# Altium project MosaicT_RCB.PrjPcb
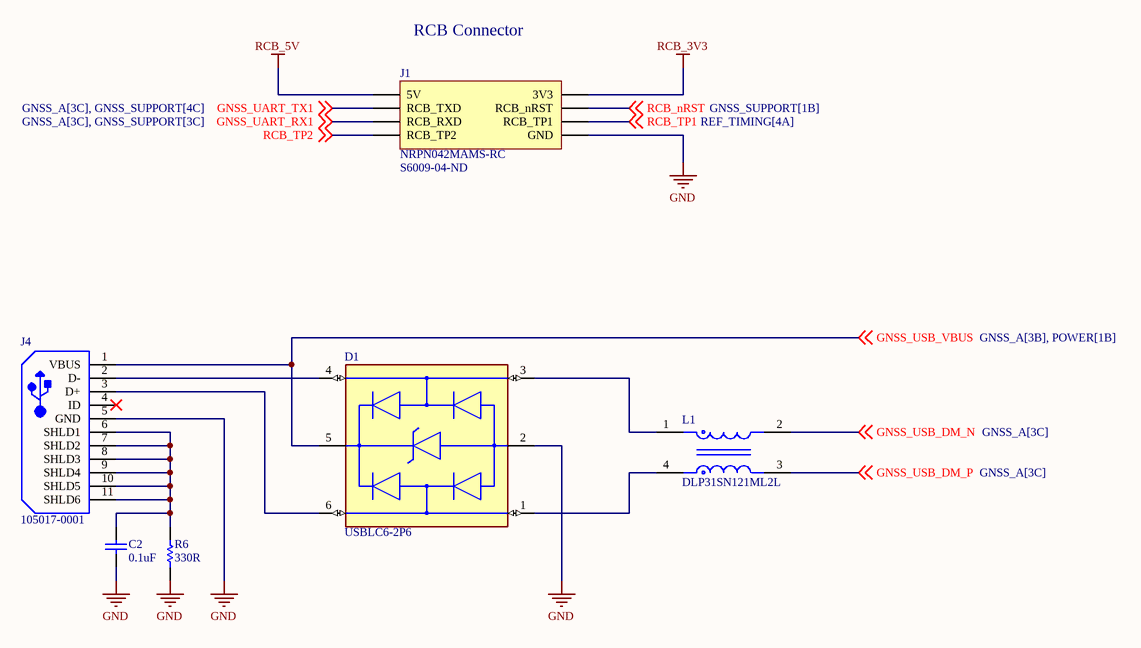
[diagram p0: CONNECTORS.SchDoc]
6 sheets, 78 parts. Net scope: global (net labels, ports and power ports of the same name join across sheets).
Board file: MOSAIC_RCB.PcbDoc
Sheets:
  CONNECTORS.SchDoc
  GNSS_A.SchDoc
  GNSS_B.SchDoc
  GNSS_SUPPORT.SchDoc
  REF_TIMING.SchDoc
  POWER.SchDoc

## Sheet CONNECTORS.SchDoc
size A4; SheetNumber: 2; SheetTotal: 7

### Parts
C2  0.1uF  [CAPC1005X56X25LL10T15]
D1  USBLC6-2P6  [FP-SOT-666-MFG]
J1  NRPN042MAMS-RC  Supplier Part Number 1: S6009-04-ND  [NRPN042MAMS-RC]
J4  105017-0001  [USB-MICRO-B_V]
L1  DLP31SN121ML2L  [FP-DLP31SN-MFG]
R6  330R  [RESC1005X40X25ML05T05]

### Nets
GND: C2.1 D1.2(GND) J1.8(GND) J4.5(GND) R6.1
RCB_3V3: J1.2(3V3)
RCB_5V: J1.1(5V)
GNSS_UART_RX1: J1.5(RCB_RXD) ; off-sheet GNSS_UART_RX1
GNSS_UART_TX1: J1.3(RCB_TXD) ; off-sheet GNSS_UART_TX1
GNSS_USB_DM_N: L1.2 ; off-sheet GNSS_USB_DM_N
GNSS_USB_DM_P: L1.3 ; off-sheet GNSS_USB_DM_P
GNSS_USB_VBUS: D1.5(VBUS) J4.1(VBUS) ; off-sheet GNSS_USB_VBUS
RCB_nRST: J1.4(RCB_nRST) ; off-sheet RCB_nRST
RCB_TP1: J1.6(RCB_TP1) ; off-sheet RCB_TP1
RCB_TP2: J1.7(RCB_TP2) ; off-sheet RCB_TP2
NetC2_2: C2.2 J4.6(SHLD1) J4.7(SHLD2) J4.8(SHLD3) J4.9(SHLD4) J4.10(SHLD5) J4.11(SHLD6) R6.2
NetD1_1: D1.1(I/O1) L1.4
NetD1_3: D1.3(I/O2) L1.1
NetD1_4: D1.4(I/O2) J4.2(D-)
NetD1_6: D1.6(I/O1) J4.3(D+)

Not connected (* = marked no-connect by the designer): J4 4(ID)*

### Notes on the sheet
- RCB Connector

### Library data of the parts
C2 = CMP-2008-02743-1: Manufacturer: AVX Interconnect / Elco; Part Number: 04026D104KAT2A
D1 = CMP-12225-000058-1: TVS DIODE 5.25V 17V SOT666; Min Breakdown Voltage: 6V; Power Line Protection: Yes; Element Configuration: Dual; Test Current: 1mA; Working Voltage: 5V; Number of Channels: 2; Max Reverse Leakage Current: 150nA; Direction: Unidirectional; Peak Pulse Current: 5A; Number of Elements: 1; Capacitance: 3.5pF; Max Breakdown Voltage: 6V; Height: 0.6mm; Depth: 1.3mm; Contact Plating: Tin; Reverse Breakdown Voltage: 6V; REACH SVHC: No SVHC; Operating Supply Voltage: 5V; Width: 1.3mm; Max Operating Temperature: 125°C; Reverse Standoff Voltage: 5V; ESD Protection: Yes; Package Quantity: 1; Termination: SMD/SMT; Length: 1.7mm; Leakage Current: 150nA; Number of Bidirectional Channels: 2; Case/Package: SOT-666; Min Operating Temperature: -40°C; Number of Pins: 6; Clamping Voltage: 17V; Breakdown Voltage: 6V; Lead Free: Lead Free; Radiation Hardening: No; Packaging: Tape and Reel; Mount: Surface Mount; Polarity: Unidirectional
J1 = NRPN042MAMS-RC: Dual Row 8 Position 2 mm Pitch Surface Mount Header; Manufacturer: Sullins; Number of Positions: 8; Connector Type: Male Pin; Pitch: 0.079inch; Supplier 1: Digi-Key; Manufacturer Part Number: NRPN042MAMS-RC; RoHS: Yes; Category: Connectors; Stock 1: 10801; Pricing 1: 1=0.76000, 76=0.60237, 152=0.57618, 456=0.47143, 988=0.41904, 4940=0.37830 (USD); Mount: Surface Mount; Color: Black; Contact Plating: Gold; Contact Material: Brass; Housing Material: Nylon; Package Quantity: 1000; Number of Rows: 2; Packaging: Bulk; Termination: Solder; Contact Type: Male Pin; Length: 8mm; Width: 4mm; Height: 1.5mm; Row Spacing: 0.079inch; Contact Mating Length: 0.141inch; Lead Free: Lead Free; RoHS Compliant: Yes; ComponentLink1URL: https://datasheet.ciiva.com/711/nrpnxx2mamx-rc-10495-d-711179.pdf?src-supplier=Digi-Key; ComponentLink1Description: https://datasheet.ciiva.com/711/nrpnxx2mamx-rc-10495-d-711179.pdf?src-supplier=Digi-Key
J4 = CMP-2000-05827-1: Micro-USB B Receptacle, Right Angle, Bottom Mount, Surface Mount, with Solder Tabs, -30 to 85 degC, 5-Pin USB, RoHS, Tape and Reel; Manufacturer: Molex; Featured Product: Micro-USBConnectorsUSBConnectors; Other Names: WM1399DKR; Package Version: Rev. F, 12/2012; Number of Contacts: 5; Connector Type: USB-microB; Catalog Drawings: 1050170001; 3D Model: 105017-0001.stp; Mating Products: WM17145-ND-CABLEMICROUSBBTOSTDA1.0MWM17147-ND-CABLEMICROUSBBTOSTDA2.0MWM17146-ND-CABLEMICROUSBBTOSTDA1.5M; PCN Assembly/Origin: ResinSupplier21/Oct/2015; Voltage - Max: 30V; Online Catalog: Molex-MicroUSB; Manufacturer URL: http://www.molex.com/; Package Description: 5-Leads USB, Micro B, Body 7.5 x 5 mm, Pitch 0.65 mm; Datasheet URL: http://www.molex.com/elqNow/elqRedir.htm?ref=http://www.molex.com/webdocs/datasheets/pdf/en-us/1050170001_IO_CONNECTORS.pdf; Ingress Protection: -; Datasheet Version: 03/2016; Mounting Type: BoardCutout,SurfaceMount,RightAngle; Circuits: 5; Standard Package: 1; Package Reference: MICRO-B; Package URL: http://www.molex.com/pdm_docs/sd/1050170001_sd.pdf; Category: Connectors,Interconnects; Series: -; RoHS Information: 1050170001CertofCompliance; Features: Shielded,SolderRetention; Family: USB,DVI,HDMIConnectors; Specifications: -; Gender: Receptacle; Packaging: Digi-Reel®; Mounting Technology: SurfaceMount
L1 = CMP-06045-000038-1: CMC 100MA 2LN 120 OHM SMD; Number of Lines: 2; Impedance: 120R; Shielding: Unshielded; Voltage Rating: 16V; Tolerance: 20%; DC Resistance (DCR): 2R; Test Frequency: 100MHz; Packaging: Tape and Reel; Depth: 1.75mm; Max Operating Temperature: 85°C; Current: 100mA; DC Current: 100mA; Case Code (Metric): 3216; Radiation Hardening: No; Military Standard: Not; Min Operating Temperature: -40°C; Package Quantity: 1; Length: 3.2mm; Current Rating: 100mA; Max DC Current: 100mA; Height: 1.15mm; Lead Free: Lead Free; Termination: SMD/SMT; Case Code (Imperial): 1206; Case/Package: 1206; Width: 0.063inch; Mount: Surface Mount
R6 = CMP-2002-01143-1: Manufacturer: Panasonic; Part Number: ERJ2RKF3300X

## Sheet GNSS_A.SchDoc
size A4; SheetNumber: 3; SheetTotal: 7
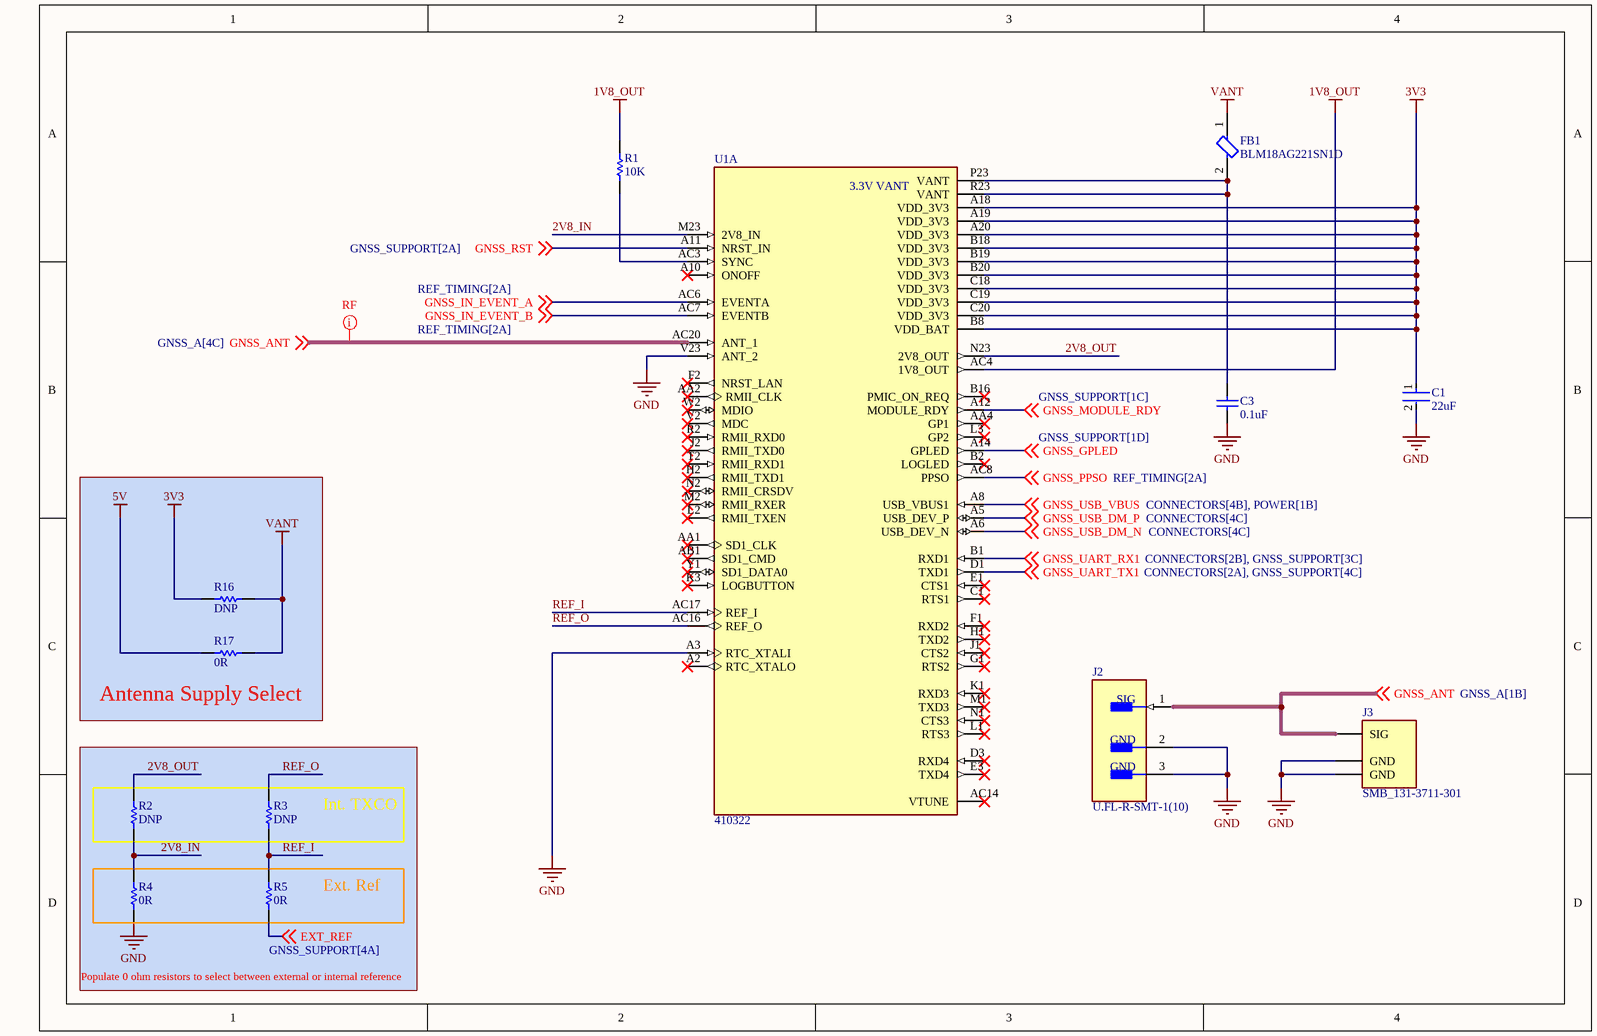
[diagram p1: GNSS_A.SchDoc]

### Parts
C1  22uF  [FP-CL10-IPC_B]
C3  0.1uF  [CAPC1005X56X25LL10T15]
FB1  BLM18AG221SN1D  [FP-BLM18-0_15-t0_8-IPC_A]
J2  U.FL-R-SMT-1(10)  [FP-U_FL-R-SMT-1_10-MFG]
J3  SMB_131-3711-301  [SMB_131-3711-301]
R1  10K  [RESC1005X40X25LL05T10]
R2  DNP  [RESC1005X40X25NL05T10]
R3  DNP  [RESC1005X40X25NL05T10]
R4  0R  [RESC1005X40X25NL05T10]
R5  0R  [RESC1005X40X25NL05T10]
R16  DNP  [RESC1005X40X25NL05T10]
R17  0R  [RESC1005X40X25NL05T10]
U1  410322  [LGA239C127P23X23_3100X3100X417N]  (part A of 3)

### Blocks framed on the sheet
Antenna Supply Select: R16 R17
Int. TXCO: R2 R3
Ext. Ref: R4 R5

### Nets
1V8_OUT: R1.2 U1.AC4(1V8_OUT)
3V3: C1.1 R16.1 U1.A18(VDD_3V3) U1.A19(VDD_3V3) U1.A20(VDD_3V3) U1.B8(VDD_BAT) U1.B18(VDD_3V3) U1.B19(VDD_3V3) U1.B20(VDD_3V3) U1.C18(VDD_3V3) U1.C19(VDD_3V3) U1.C20(VDD_3V3)
5V: R17.1
GND: C1.2 C3.1 J2.2(GND) J2.3(GND) J3.2(GND) J3.3(GND) R4.2 U1.A3(RTC_XTALI) U1.V23(ANT_2)
VANT: FB1.1 R16.2 R17.2
2V8_IN: R2.2 R4.1 U1.M23(2V8_IN)
2V8_OUT: R2.1 U1.N23(2V8_OUT)
EXT_REF: R5.2 ; off-sheet EXT_REF
GNSS_ANT: J2.1(SIG) J3.1(SIG) U1.AC20(ANT_1) ; off-sheet GNSS_ANT
GNSS_GPLED: U1.A14(GPLED) ; off-sheet GNSS_GPLED
GNSS_IN_EVENT_A: U1.AC6(EVENTA) ; off-sheet GNSS_IN_EVENT_A
GNSS_IN_EVENT_B: U1.AC7(EVENTB) ; off-sheet GNSS_IN_EVENT_B
GNSS_MODULE_RDY: U1.A12(MODULE_RDY) ; off-sheet GNSS_MODULE_RDY
GNSS_PPSO: U1.AC8(PPSO) ; off-sheet GNSS_PPSO
GNSS_RST: U1.A11(NRST_IN) ; off-sheet GNSS_RST
GNSS_UART_RX1: U1.B1(RXD1) ; off-sheet GNSS_UART_RX1
GNSS_UART_TX1: U1.D1(TXD1) ; off-sheet GNSS_UART_TX1
GNSS_USB_DM_N: U1.A6(USB_DEV_N) ; off-sheet GNSS_USB_DM_N
GNSS_USB_DM_P: U1.A5(USB_DEV_P) ; off-sheet GNSS_USB_DM_P
GNSS_USB_VBUS: U1.A8(USB_VBUS1) ; off-sheet GNSS_USB_VBUS
REF_I: R3.2 R5.1 U1.AC17(REF_I)
REF_O: R3.1 U1.AC16(REF_O)
NetC3_2: C3.2 FB1.2 U1.P23(VANT) U1.R23(VANT)
NetR1_1: R1.1 U1.AC3(SYNC)

Not connected (* = marked no-connect by the designer): U1 A2(RTC_XTALO)* A10(ONOFF)* AA1(SD1_CLK)* AA2(RMII_CLK)* AA4(GP1)* AB1(SD1_CMD)* AC14(VTUNE)* B2(LOGLED)* B16(PMIC_ON_REQ)* C1(RTS1)* D3(RXD4)* E1(CTS1)* E3(TXD4)* F1(RXD2)* F2(NRST_LAN)* G1(RTS2)* H1(TXD2)* H2(RMII_TXD1)* J1(CTS2)* J2(RMII_TXD0)* K1(RXD3)* K3(LOGBUTTON)* L1(RTS3)* L2(RMII_TXEN)* L3(GP2)* M1(TXD3)* M2(RMII_RXER)* N1(CTS3)* N2(RMII_CRSDV)* R2(RMII_RXD0)* T2(RMII_RXD1)* V2(MDC)* W2(MDIO)* Y1(SD1_DATA0)*

### Layout directives
net class RF: GNSS_ANT

### Notes on the sheet
- (near U1) 3.3V VANT
- Populate 0 ohm resistors to select between external or internal reference

### Library data of the parts
C1 = CMP-13271-003290-1: Cap Ceramic 22uF 10V X5R ±20% Pad SMD 0603 +85°C T/R; Max Operating Temperature: 85°C; Packaging: Tape and Reel; Mount: Surface Mount; Width: 0.031inch; Length: 0.063inch; Min Operating Temperature: -55°C; Voltage Rating: 10V; Case/Package: 0603; Thickness: 0.037inch; Case Code (Metric): 1608; Tolerance: 20%; Case Code (Imperial): 0603; Capacitance: 22uF
C3 = CMP-2008-02743-1: as C2 on sheet CONNECTORS
FB1 = CMP-0686-00445-3: Chip Ferrite Bead, 0603, 220Ω @ 100MHz, 0.25Ω, 25%, 700mA; DC Current: 500mA; DC Resistance-Max: 250mR; Shielding: Unshielded; Material: Steel; Impedance: 220R; Number of Lines: 1; Max Operating Temperature: 125°C; Military Standard: Not; Min Operating Temperature: -55°C; Max DC Current: 500mA; Case/Package: 0603; Termination: SMD/SMT; Current Rating: 500mA; REACH SVHC: No SVHC; Depth: 0.8mm; Number of Pins: 2; Radiation Hardening: No; Length: 1.6mm; Packaging: Tape and Reel; Test Frequency: 100MHz; Series: BLM18A; Package Quantity: 1; Tolerance: 25%; Case Code (Imperial): 0603; DC Resistance (DCR): 250mR; Height: 0.8mm; Lead Free: Lead Free; Width: 0.8mm; Case Code (Metric): 1608; RoHS Compliant: Yes; Frequency: 100MHz; Core Material: Ferrite; Number of Circuits: 1; Max Current Rating: 500mA
J2 = CMP-2000-05152-3: CONN U.FL RCPT STR 50 OHM SMD; Max Frequency: 6GHz; Connector Type: Coaxial; Body Plating: Silver; Body Material: Bronze; Impedance: 50R; Dielectric Material: Polymer; Insulation Resistance: 500MR; Gender: Male; Packaging: Cut Tape; Length: 3mm; Package Quantity: 2500; Termination: Solder; Lead Free: Lead Free; Series: U.FL; Min Operating Temperature: -40°C; Fastening Type: Snap; Contact Material: Brass; Orientation: Straight; Wire/Cable Type: Coaxial; Frequency: 6GHz; Contact Plating: Gold; Depth: 3.1mm; Weight: 0.001764oz; Max Operating Temperature: 90°C; Radiation Hardening: No; REACH SVHC: No SVHC; Mount: Surface Mount; Housing Color: Beige
J3 = SMB_131-3711-301: Rf Coaxial Board Mount Connector; Manufacturer: Bel Cinch; Body Material: Brass; Plating: Nickel; Body Plating: Gold; Dielectric Material: PTFE; Impedance: 50R; Voltage Rating: 335V; Gender: Female; Frequency: 4Hz; Connector Type: SMB,Male Pin; Max Frequency: 4GHz; Polarity: Reverse; Operating Frequency: 0 to 4 Hz to GHz; Supplier 1: Digi-Key; Manufacturer Part Number: 131-3711-301; RoHS: Yes; Category: RF / Coaxial Connectors; Stock 1: 475; Pricing 1: 1=7.75000, 10=7.00900, 25=6.62160, 50=6.46000, 100=6.13700, 250=5.49100, 500=5.16800, 1000=4.52200 (USD); Mount: Surface Mount; Case/Package: SMA; Contact Material: Brass; Contact Plating: Gold,Nickel; Housing Color: Gold; Shell Plating: Nickel; Center Contact Plating: Gold; Min Operating Temperature: -65°C; Max Operating Temperature: 165°C; Package Quantity: 25; Packaging: Bulk; Fastening Type: SNAP-ON; Termination: Solder; Orientation: Right Angle; ComponentLink1URL: http://www.mouser.com/Search/include/RoHSCompliant.aspx?qs=sxnx5FoGSWlI%252bs7K%252boh9Yg%3d%3d&src-supplier=Mouser; ComponentLink1Description: http://www.mouser.com/Search/include/RoHSCompliant.aspx?qs=sxnx5FoGSWlI%252bs7K%252boh9Yg%3d%3d&src-supplier=Mouser; ComponentLink2URL: http://www.mouser.com/Search/include/RoHSCompliant.aspx?qs=BzWiDxlKIe%2fRhe5ZDRBb2Q%3d%3d&src-supplier=Mouser; ComponentLink2Description: http://www.mouser.com/Search/include/RoHSCompliant.aspx?qs=BzWiDxlKIe%2fRhe5ZDRBb2Q%3d%3d&src-supplier=Mouser; ComponentLink3URL: http://www.onlinecomponents.com/datasheet/1313711301.aspx?p=11276490&src-supplier=Onlinecomponents.com; ComponentLink3Description: http://www.onlinecomponents.com/datasheet/1313711301.aspx?p=11276490&src-supplier=Onlinecomponents.com; ComponentLink4URL: http://www.mouser.com/Search/include/RoHSCompliant.aspx?qs=sxnx5FoGSWlgU0HI%252bkNgTA%3d%3d&src-supplier=Mouser; ComponentLink4Description: http://www.mouser.com/Search/include/RoHSCompliant.aspx?qs=sxnx5FoGSWlgU0HI%252bkNgTA%3d%3d&src-supplier=Mouser; ComponentLink5URL: http://www.mouser.com/Search/include/RoHSCompliant.aspx?qs=p2XSgoD%252b2ikka7OcbAcBow%3d%3d&src-supplier=Mouser; ComponentLink5Description: http://www.mouser.com/Search/include/RoHSCompliant.aspx?qs=p2XSgoD%252b2ikka7OcbAcBow%3d%3d&src-supplier=Mouser; ComponentLink6URL: http://www.mouser.com/Search/include/RoHSCompliant.aspx?qs=CoHYZihNMM5AOHZHjTCMkA%3d%3d&src-supplier=Mouser; ComponentLink6Description: http://www.mouser.com/Search/include/RoHSCompliant.aspx?qs=CoHYZihNMM5AOHZHjTCMkA%3d%3d&src-supplier=Mouser; ComponentLink7URL: http://www.mouser.com/Search/include/RoHSCompliant.aspx?qs=hJAXt0VUbWsyDbF0CdNvSg%3d%3d&src-supplier=Mouser; ComponentLink7Description: http://www.mouser.com/Search/include/RoHSCompliant.aspx?qs=hJAXt0VUbWsyDbF0CdNvSg%3d%3d&src-supplier=Mouser; Supplier Part Number 1: J10507-ND
R1 = CMP-2002-07353-1: Part Number: RC0402FR-0710KL; Manufacturer: Yageo / Phycomp
R2-R5 R16 R17 = CMP-1011-00001-2: Manufacturer: Yageo / Phycomp; Part Number: RC0402JR-070RL
U1 = 410322: mosaicâ„¢-X5 RF Receiver BeiDou, Galileo, GLONASS, GNSS, GPS; MF: Septentrio Inc.; Value: *; Check_prices: https://www.snapeda.com/parts/410322/ept/view-part/?ref=eda; Purchase-URL: https://pricing.snapeda.com/search/part/410322/?ref=eda; Price: None; MP: 410322; SnapEDA_Link: https://www.snapeda.com/parts/410322/ept/view-part/?ref=snap; Availability: In Stock; Package: None

## Sheet GNSS_B.SchDoc
size A; SheetNumber: 4; SheetTotal: 7
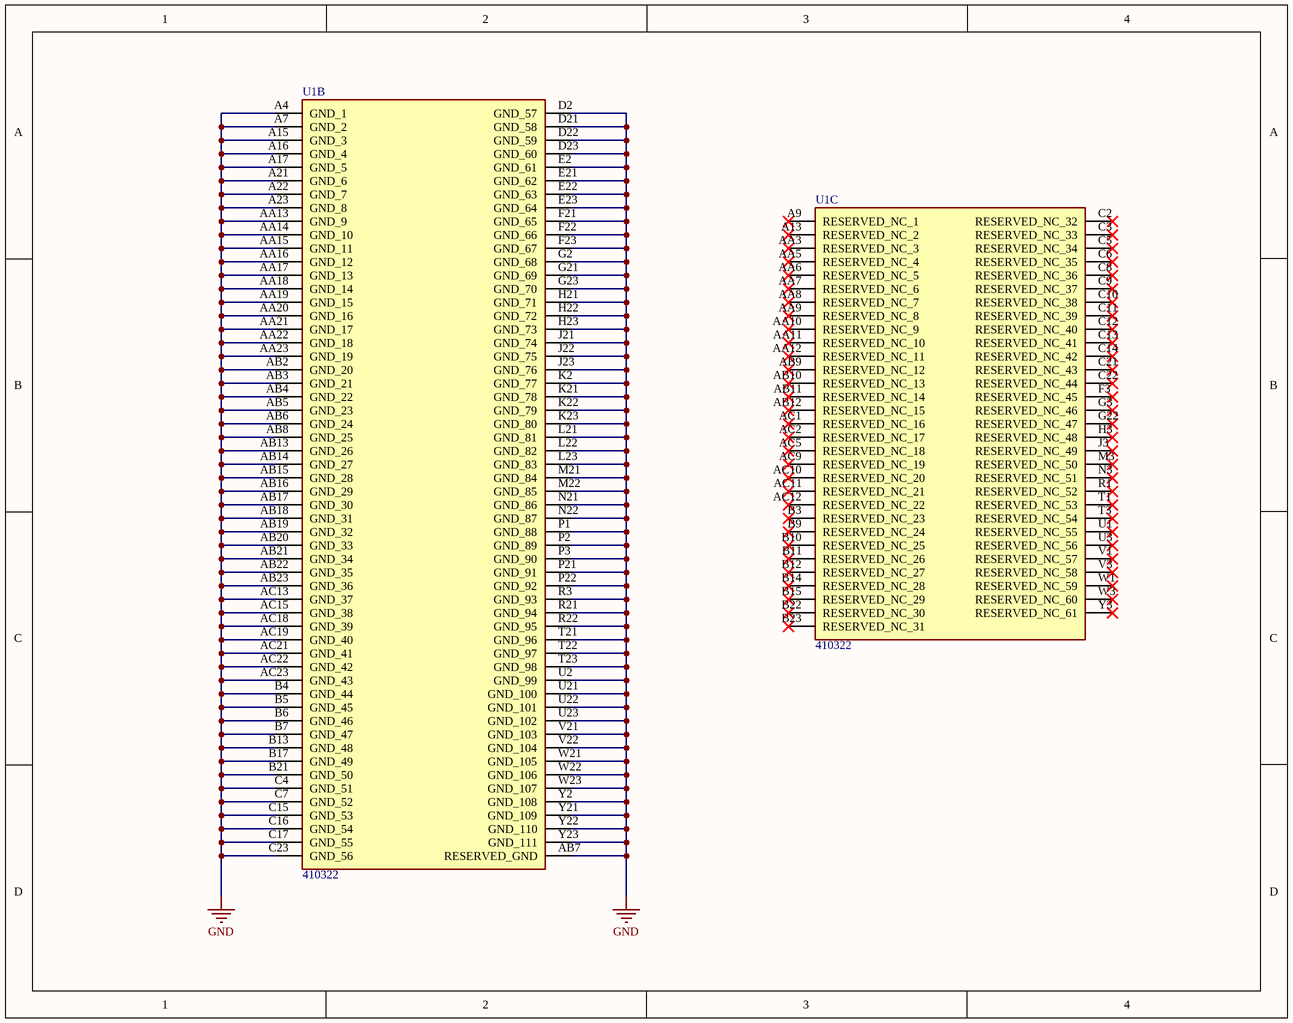
[diagram p2: GNSS_B.SchDoc]

### Parts
U1  410322  [LGA239C127P23X23_3100X3100X417N]  (parts B,C of 3)

### Nets
GND: U1.A4(GND_1) U1.A7(GND_2) U1.A15(GND_3) U1.A16(GND_4) U1.A17(GND_5) U1.A21(GND_6) U1.A22(GND_7) U1.A23(GND_8) U1.AA13(GND_9) U1.AA14(GND_10) U1.AA15(GND_11) U1.AA16(GND_12) U1.AA17(GND_13) U1.AA18(GND_14) U1.AA19(GND_15) U1.AA20(GND_16) U1.AA21(GND_17) U1.AA22(GND_18) U1.AA23(GND_19) U1.AB2(GND_20) U1.AB3(GND_21) U1.AB4(GND_22) U1.AB5(GND_23) U1.AB6(GND_24) U1.AB7(RESERVED_GND) U1.AB8(GND_25) U1.AB13(GND_26) U1.AB14(GND_27) U1.AB15(GND_28) U1.AB16(GND_29) U1.AB17(GND_30) U1.AB18(GND_31) U1.AB19(GND_32) U1.AB20(GND_33) U1.AB21(GND_34) U1.AB22(GND_35) U1.AB23(GND_36) U1.AC13(GND_37) U1.AC15(GND_38) U1.AC18(GND_39) U1.AC19(GND_40) U1.AC21(GND_41) U1.AC22(GND_42) U1.AC23(GND_43) U1.B4(GND_44) U1.B5(GND_45) U1.B6(GND_46) U1.B7(GND_47) U1.B13(GND_48) U1.B17(GND_49) U1.B21(GND_50) U1.C4(GND_51) U1.C7(GND_52) U1.C15(GND_53) U1.C16(GND_54) U1.C17(GND_55) U1.C23(GND_56) U1.D2(GND_57) U1.D21(GND_58) U1.D22(GND_59) U1.D23(GND_60) U1.E2(GND_61) U1.E21(GND_62) U1.E22(GND_63) U1.E23(GND_64) U1.F21(GND_65) U1.F22(GND_66) U1.F23(GND_67) U1.G2(GND_68) U1.G21(GND_69) U1.G23(GND_70) U1.H21(GND_71) U1.H22(GND_72) U1.H23(GND_73) U1.J21(GND_74) U1.J22(GND_75) U1.J23(GND_76) U1.K2(GND_77) U1.K21(GND_78) U1.K22(GND_79) U1.K23(GND_80) U1.L21(GND_81) U1.L22(GND_82) U1.L23(GND_83) U1.M21(GND_84) U1.M22(GND_85) U1.N21(GND_86) U1.N22(GND_87) U1.P1(GND_88) U1.P2(GND_89) U1.P3(GND_90) U1.P21(GND_91) U1.P22(GND_92) U1.R3(GND_93) U1.R21(GND_94) U1.R22(GND_95) U1.T21(GND_96) U1.T22(GND_97) U1.T23(GND_98) U1.U2(GND_99) U1.U21(GND_100) U1.U22(GND_101) U1.U23(GND_102) U1.V21(GND_103) U1.V22(GND_104) U1.W21(GND_105) U1.W22(GND_106) U1.W23(GND_107) U1.Y2(GND_108) U1.Y21(GND_109) U1.Y22(GND_110) U1.Y23(GND_111)

Not connected (* = marked no-connect by the designer): U1 A9(RESERVED_NC_1)* A13(RESERVED_NC_2)* AA3(RESERVED_NC_3)* AA5(RESERVED_NC_4)* AA6(RESERVED_NC_5)* AA7(RESERVED_NC_6)* AA8(RESERVED_NC_7)* AA9(RESERVED_NC_8)* AA10(RESERVED_NC_9)* AA11(RESERVED_NC_10)* AA12(RESERVED_NC_11)* AB9(RESERVED_NC_12)* AB10(RESERVED_NC_13)* AB11(RESERVED_NC_14)* AB12(RESERVED_NC_15)* AC1(RESERVED_NC_16)* AC2(RESERVED_NC_17)* AC5(RESERVED_NC_18)* AC9(RESERVED_NC_19)* AC10(RESERVED_NC_20)* AC11(RESERVED_NC_21)* AC12(RESERVED_NC_22)* B3(RESERVED_NC_23)* B9(RESERVED_NC_24)* B10(RESERVED_NC_25)* B11(RESERVED_NC_26)* B12(RESERVED_NC_27)* B14(RESERVED_NC_28)* B15(RESERVED_NC_29)* B22(RESERVED_NC_30)* B23(RESERVED_NC_31)* C2(RESERVED_NC_32)* C3(RESERVED_NC_33)* C5(RESERVED_NC_34)* C6(RESERVED_NC_35)* C8(RESERVED_NC_36)* C9(RESERVED_NC_37)* C10(RESERVED_NC_38)* C11(RESERVED_NC_39)* C12(RESERVED_NC_40)* C13(RESERVED_NC_41)* C14(RESERVED_NC_42)* C21(RESERVED_NC_43)* C22(RESERVED_NC_44)* F3(RESERVED_NC_45)* G3(RESERVED_NC_46)* G22(RESERVED_NC_47)* H3(RESERVED_NC_48)* J3(RESERVED_NC_49)* M3(RESERVED_NC_50)* N3(RESERVED_NC_51)* R1(RESERVED_NC_52)* T1(RESERVED_NC_53)* T3(RESERVED_NC_54)* U1(RESERVED_NC_55)* U3(RESERVED_NC_56)* V1(RESERVED_NC_57)* V3(RESERVED_NC_58)* W1(RESERVED_NC_59)* W3(RESERVED_NC_60)* Y3(RESERVED_NC_61)*

### Library data of the parts
U1 = 410322: as U1 on sheet GNSS_A; Value: *; Check_prices: https://www.snapeda.com/parts/410322/ept/view-part/?ref=eda; Purchase-URL: https://pricing.snapeda.com/search/part/410322/?ref=eda; Price: None; MP: 410322; SnapEDA_Link: https://www.snapeda.com/parts/410322/ept/view-part/?ref=snap; Availability: In Stock; Package: None

## Sheet GNSS_SUPPORT.SchDoc
size A4; SheetNumber: 5; SheetTotal: 7
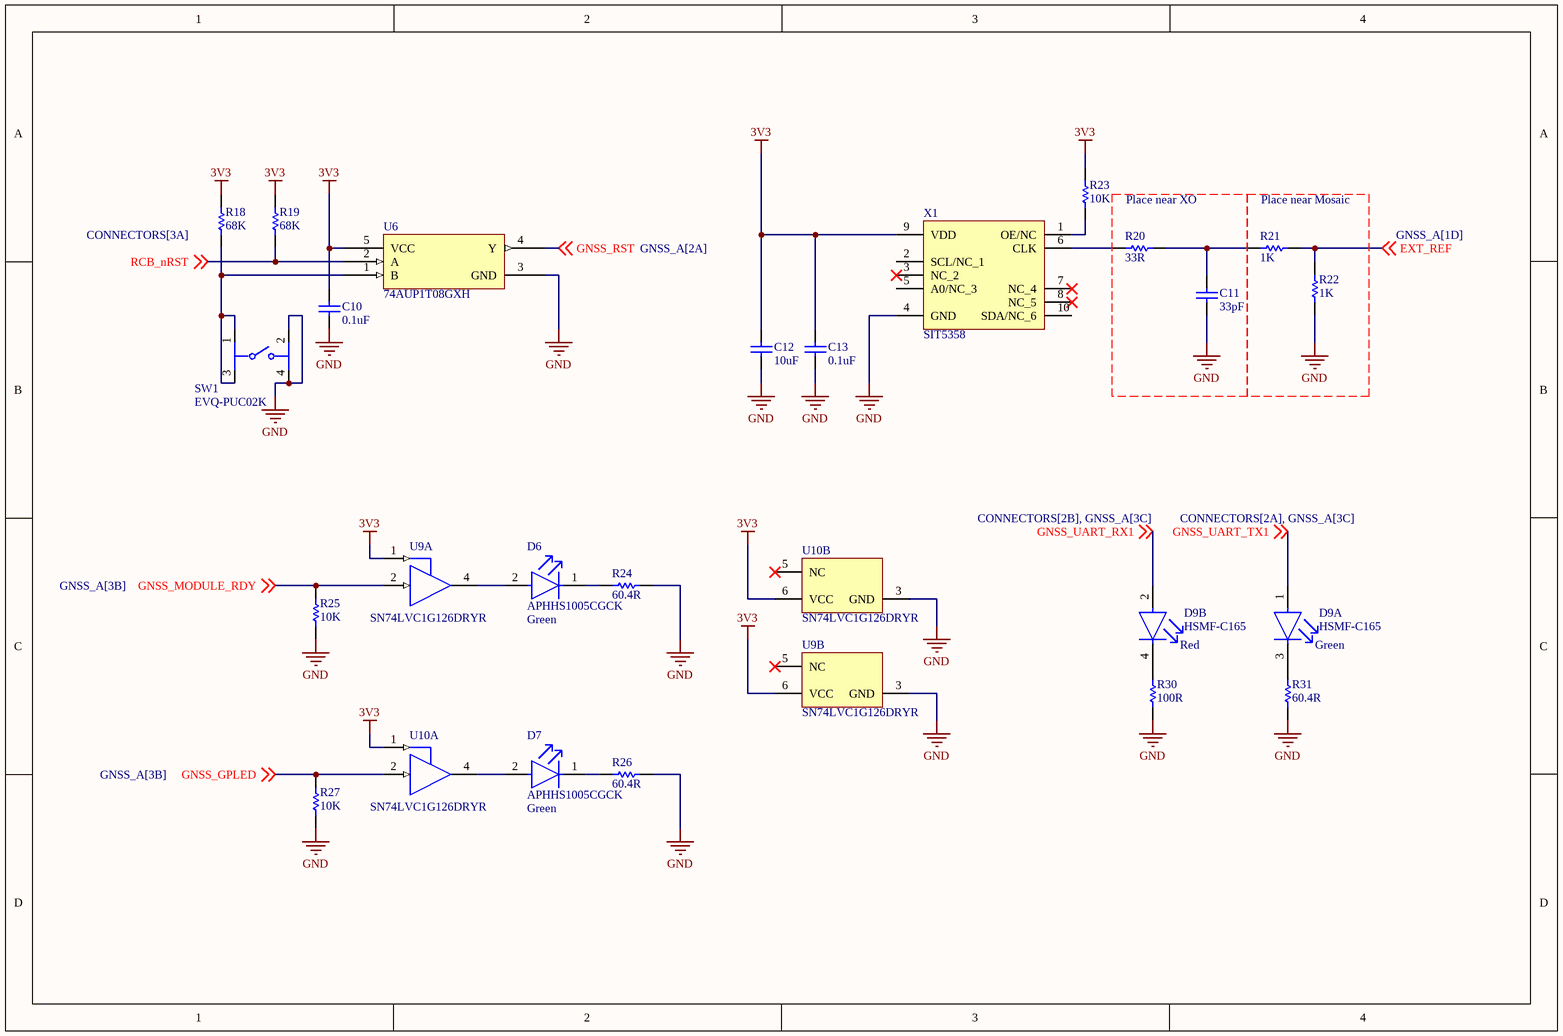
[diagram p3: GNSS_SUPPORT.SchDoc]

### Parts
C10  0.1uF  [CAPC1005X56X25LL10T15]
C11  33pF  [CAPC1005X55X25ML05T10]
C12  10uF  [CAPC1005X70X10LL05]
C13  0.1uF  [CAPC1005X56X25LL10T15]
D6  APHHS1005CGCK  Color: Green  [FP-APHHS1005CGCK-MFG]
D7  APHHS1005CGCK  Color: Green  [FP-APHHS1005CGCK-MFG]
D9  HSMF-C165  [FP-HSMF-C165-MFG]  (parts A,B of 2)
R18  68K  [RESC1005X40X25LL10T10]
R19  68K  [RESC1005X40X25LL10T10]
R20  33R  [RESC1005X40X25LL05T10]
R21  1K  [RESC1005X40X25LL05T10]
R22  1K  [RESC1005X40X25LL05T10]
R23  10K  [RESC1005X40X25ML05T10]
R24  60.4R  [RESC1005X40X25ML05T05]
R25  10K  [RESC1005X40X25ML05T10]
R26  60.4R  [RESC1005X40X25ML05T05]
R27  10K  [RESC1005X40X25ML05T10]
R30  100R  [RESC1005X40X25LL05T05]
R31  60.4R  [RESC1005X40X25ML05T05]
SW1  EVQ-PUC02K  [FP-EVQ-PUC02K-MFG]
U6  74AUP1T08GXH  [X2SON5_SOT1226_NEX]
U9  SN74LVC1G126DRYR  [DRY0006A_V]  (parts A,B of 2)
U10  SN74LVC1G126DRYR  [DRY0006A_V]  (parts A,B of 2)
X1  SIT5358  [SIT5358]

### Nets
3V3: C10.2 C12.2 C13.2 R18.2 R19.2 R23.2 U6.5(VCC) U9.1(OE) U9.6(VCC) U10.1(OE) U10.6(VCC) X1.9(VDD)
GND: C10.1 C11.1 C12.1 C13.1 R22.1 R24.1 R25.1 R26.1 R27.1 R30.1 R31.2 SW1.2 SW1.4 U6.3(GND) U9.3(GND) U10.3(GND) X1.4(GND)
EXT_REF: R21.2 R22.2 ; off-sheet EXT_REF
GNSS_GPLED: R27.2 U10.2(A) ; off-sheet GNSS_GPLED
GNSS_MODULE_RDY: R25.2 U9.2(A) ; off-sheet GNSS_MODULE_RDY
GNSS_RST: U6.4(Y) ; off-sheet GNSS_RST
GNSS_UART_RX1: D9.2(RED_A) ; off-sheet GNSS_UART_RX1
GNSS_UART_TX1: D9.1(GREEN_A) ; off-sheet GNSS_UART_TX1
RCB_nRST: R19.1 U6.2(A) ; off-sheet RCB_nRST
NetC11_2: C11.2 R20.2 R21.1
NetD6_1: D6.1(C) R24.2
NetD6_2: D6.2(A) U9.4(Y)
NetD7_1: D7.1(C) R26.2
NetD7_2: D7.2(A) U10.4(Y)
NetD9_3: D9.3(GREEN_C) R31.1
NetD9_4: D9.4(RED_C) R30.2
NetR18_1: R18.1 SW1.1 SW1.3 U6.1(B)
NetR20_1: R20.1 X1.6(CLK)
NetR23_1: R23.1 X1.1(OE/NC)

Not connected (* = marked no-connect by the designer): U9 5(NC)*; U10 5(NC)*; X1 2(SCL/NC_1) 3(NC_2)* 5(A0/NC_3) 7(NC_4)* 8(NC_5)* 10(SDA/NC_6)

### Notes on the sheet
- Place near XO
- (near R21) Place near Mosaic
- Red
- Green

### Library data of the parts
C10 C13 = CMP-2008-02743-1: as C2 on sheet CONNECTORS
C11 = CMP-2008-04338-1: Part Number: GRM1555C1H330JZ01D; Manufacturer: Murata
C12 = CMP-2000-05993-1: Chip Capacitor, 10 uF, +/- 20%, -55 to 85 degC, 0402 (1005 Metric), RoHS, Tape and Reel; PCN Part Number: MLCCPartNumberChange30/Nov/2012; Manufacturer: TDK; Voltage - Rated: 6.3V; Capacitance: 10µF; Product Training Modules: CSeriesGeneralApplicationsSEAT,CCV,andTVCLDesignToolsGuidetoReplacinganElectrolyticCapacitorwithanMLCC; Online Catalog: CSeries,GeneralPurpose; Kits: 445-9021-KIT-ND-KITMLCC100PF-10UF04026.3-50V445-9003-KIT-ND-KITCAPCERHICAPMLCCSMD; Temperature Coefficient: X5R; Other Names: 445-8920-1; Standard Package: 1; Datasheet URL: http://download.siliconexpert.com/pdfs/2015/4/21/15/54/45/779/tdk_/manual/37024850441143360mlcc_commercial_general_en.pdf; Package Description: 2-Pin Surface Mount Device, Body 1.00 x 0.50 mm; Lead Style: -; RoHS Information: RoHSCertificate-MLCC; Mounting Technology: SurfaceMount; Manufacturer URL: http://www.tdk.com/; Packaging: CutTape(CT); Series: C; Category: Capacitors; Operating Temperature: -55°C~85°C; Ratings: -; Applications: GeneralPurpose; Lead Spacing: -; Family: CeramicCapacitors; Mounting Type: SurfaceMount,MLCC; Package / Case: 0402(1005Metric); Features: -; Thickness (Max): 0.020"(0.50mm); Size / Dimension: 0.039"Lx0.020"W(1.00mmx0.50mm); Datasheet Version: 03/2015; Package Reference: 0402; Tolerance: ±20%; Height - Seated (Max): -
D6 D7 = CMP-44529-000044-1: LED GREEN CLEAR CHIP SMD; Viewing Angle: 120°; Dominant Wavelength: 570nm; Test Current: 20mA; Luminous Intensity: 50mcd; Forward Voltage: 2.1V; Number of LEDs: 1; Lens Color: Clear; Packaging: Tape and Reel; Max Operating Temperature: 85°C; Illumination Color: Green; Length: 1mm; Mount: Surface Mount; Lens Style: Clear; Number of Pins: 2; Wavelength: 570nm; Case/Package: 0402; Width: 0.5mm; Package Quantity: 2000; Case Code (Metric): 1005; Height: 0.6mm; Lead Free: Lead Free; Case Code (Imperial): 0402; Forward Current: 20mA; Min Operating Temperature: -40°C
D9 = CMP-2000-06424-2: LED GREEN/RED DIFFUSED 0603 SMD; Reverse Voltage: 5V; Dominant Wavelength: 621nm; Number of Elements: 2; Shape: Rectangular; Luminous Intensity: 10mcd; Forward Current: 20mA; Lens Color: White; Illumination Color: Green; Power Dissipation: 52mW; Wavelength: 572nm; Viewing Angle: 120°; Forward Voltage: 2.2V; Max Operating Temperature: 85°C; Lens Transparency: Diffused; Width: 0.8mm; Case/Package: 0603; Packaging: Tape and Reel; Case Code (Metric): 1608; Depth: 0.8mm; REACH SVHC: No SVHC; Number of LEDs: 2; Radiation Hardening: No; Lens Style: Rectangular; Color: Green; Case Code (Imperial): 0603; Min Operating Temperature: -40°C; Power Rating: 52mW; Number of Pins: 4; Number of Terminals: 4; Package Quantity: 1; Mount: Surface Mount; Height: 0.5mm; Length: 1.6mm; Lead Free: Lead Free; Test Current: 20mA
R18 R19 = CMP-2002-05893-1: Part Number: ERA2AEB683X; Manufacturer: Panasonic
R20 = CMP-2002-07619-1: Part Number: RC0402FR-0733RL; Manufacturer: Yageo / Phycomp
R21 R22 = CMP-2002-03045-1: Part Number: CRCW04021K00FKEDHP; Manufacturer: Vishay Dale
R23 R25 R27 = CMP-2002-03043-1: Part Number: CRCW040210K0FKEDHP; Manufacturer: Vishay Dale
R24 R26 R31 = CMP-2002-01009-1: Part Number: ERJ-2RKF6040X; Manufacturer: Panasonic
R30 = CMP-2002-00605-3: Chip Resistor, 100 Ohm, +/- 1%, 100 mW, -55 to 155 degC, 0402 (1005 Metric), RoHS, Tape and Reel; Manufacturer: Basic Passives; PartNumber: ERJ-2RKF1000X; Power Rating: 100 mW; Resistance: 100 Ohm; Voltage Rating: 50 V; Case\/Package: 0402; Width: 0.5 mm; Pins: 2; ComponentLink2Description: Datasheet; PackageReference: 0402; Height: 0.35 mm; Tolerance: 1%; DatasheetVersion: 04/2015; Case Code (Imperial): 0402; Min Operating Temperature: -55 degC; Radiation Hardening: No; Length: 1 mm; Package Quantity: 10000; PackageDescription: 2-Pin Surface Mount Device, Body 1 x 0.5 mm; Mounting Technology: Surface Mount; Case Code (Metric): 1005; Packaging: Tape and Reel; ComponentLink1URL: http://www.panasonic.com/; RoHSCompliant: true; Max Operating Temperature: 155 degC; REACH SVHC: Yes; ComponentLink1Description: Manufacturer URL; ComponentLink2URL: http://industrial.panasonic.com/cdbs/www-data/pdf/RDA0000/AOA0000C86.pdf; Mount: Surface Mount
SW1 = CMP-05618-000046-1: SWITCH TACTILE SPST-NO 0.05A 12V; Current Rating: 50mA; Operating Force: 2.2N; Actuator Color: Black; Mechanical Life: 100000Cycles; Switch Function: Off-Mom; Switch Travel: 0.3mm; Throw Configuration: SPST; Contact Resistance: 500mR; Illumination Type: Non-Illuminated; Actuator Length: 1mm; Mount: Surface Mount; Contact Plating: Silver; Series: EVQPU; Packaging: Tape and Reel; Height: 1.65mm; Radiation Hardening: No; Termination: Gull Wing; Depth: 4.5mm; Max Operating Temperature: 70°C; RoHS Compliant: Yes; Contact Current Rating: 50mA; Length: 6.4mm; Electrical Life: 100000Cycles; Max Voltage Rating (DC): 12V; Package Quantity: 1; Width: 3.5mm; Min Operating Temperature: -40°C; Max Current Rating: 50mA; Orientation: Straight; Voltage Rating (DC): 12V; Size: 3.5mm; Lead Free: Lead Free
U6 = 74AUP1T08GXH: No Description Available; Mfr_Name: Nexperia; Copyright: Copyright (C) 2023 Ultra Librarian. All rights reserved.; Manufacturer_Part_Number: 74AUP1T08GXH; Digi-Key_Part_Number_1: 1727-7785-2-ND; Digi-Key_Part_Number_2: 1727-7785-1-ND; Digi-Key_Part_Number_3: 1727-7785-6-ND; RefDes: RefDes; Type: DEV
U9 U10 = CMP-0859-00836-3: Single Bus Buffer Gate With 3-State Outputs, DRY0006A, LARGE T&R; Manufacturer: Texas Instruments; Sub-Family: Non-Inverting Buffer/Driver; Bits(#): 1; Output Type: CMOS; Output Drive (IOL/IOH)(Max)(mA): 32/-32; VCC(Min)(V): 1.65; Logic: True; Voltage(Nom)(V): 1.8,2.5,3.3,5; Input Type: CMOS/TTL; 3-State Output: Yes; F @ Nom Voltage(Max)(Mhz): 150; Schmitt Trigger: No; VCC(Max)(V): 5.5; Rating: Catalog; Technology Family: LVC; ICC @ Nom Voltage(Max)(mA): 0.01; tpd @ Nom Voltage(Max)(ns): 8,5.5,4.5,4; DatasheetVersion: SCES224R; Generic Part Number: SN74LVC1G126; PackageReference: DRY0006A; Operating Temperature Range(C): -40 to 125,-40 to 85
X1 = SIT5358: 1 to 60 MHz, ±50 ppb Super-TCXO; Manufacturer_Name: SiTime; Manufacturer_Part_Number: SIT5358AN-FR-33N0-10.000000; Geometry.Height: 1.06mm; Arrow Part Number: *; Arrow Price/Stock: *

## Sheet REF_TIMING.SchDoc
size A4; SheetNumber: 6; SheetTotal: 7
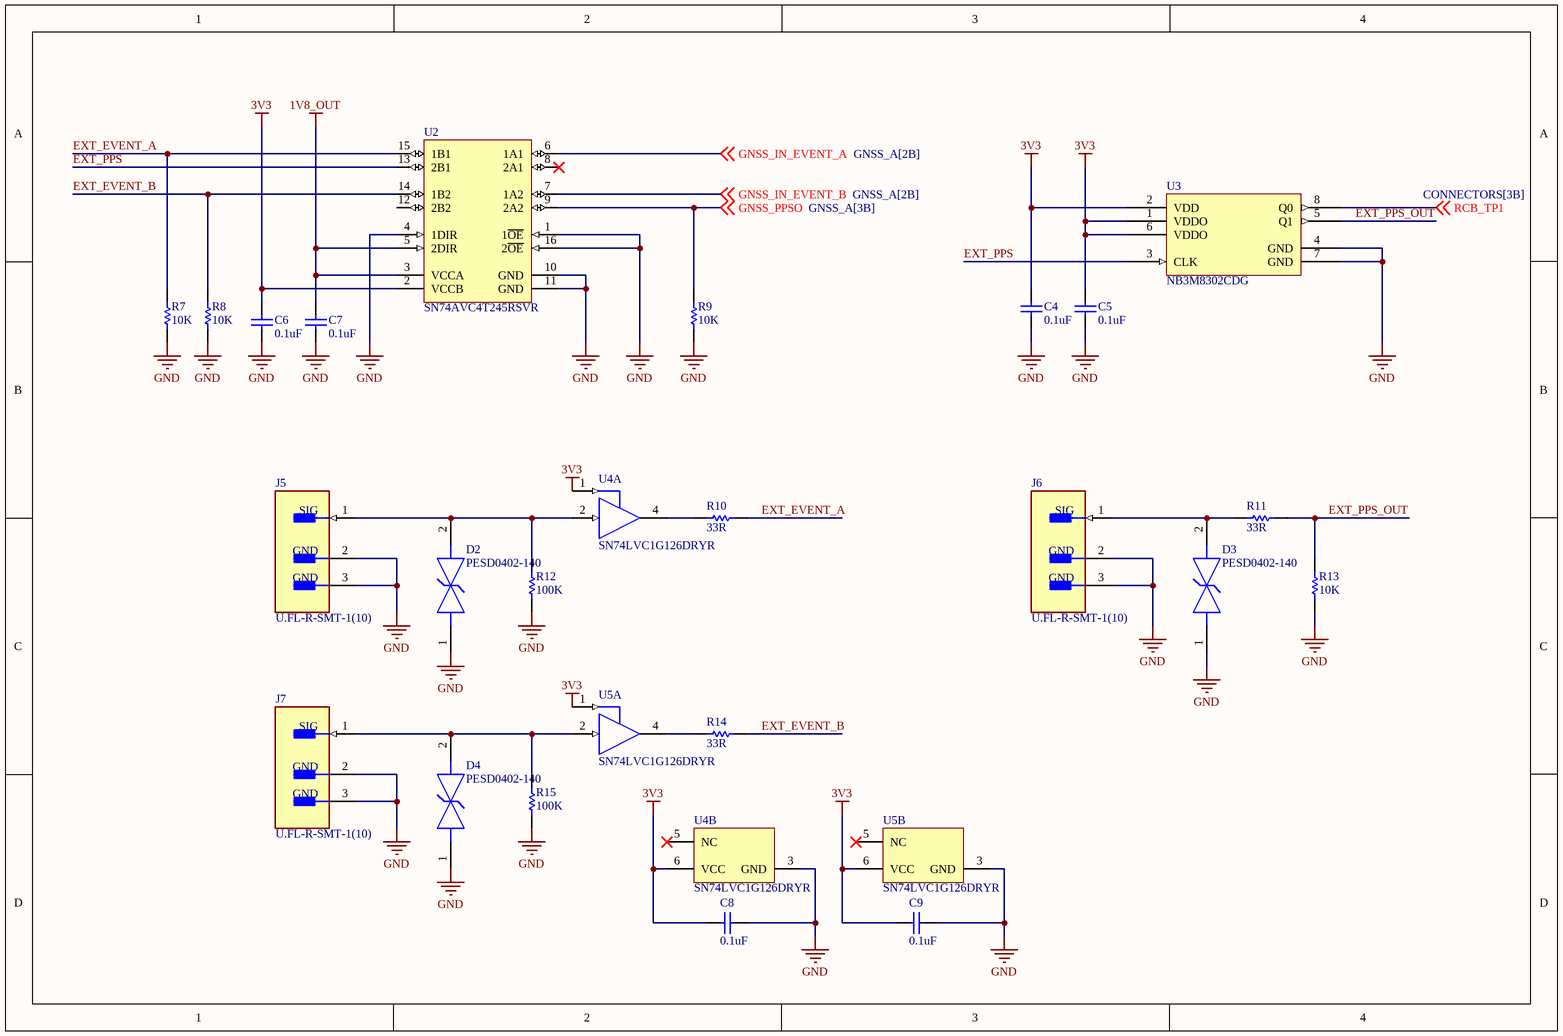
[diagram p4: REF_TIMING.SchDoc]

### Parts
C4  0.1uF  [CAPC1005X56X25LL10T15]
C5  0.1uF  [CAPC1005X56X25LL10T15]
C6  0.1uF  [CAPC1005X56X25LL10T15]
C7  0.1uF  [CAPC1005X56X25LL10T15]
C8  0.1uF  [CAPC1005X56X25LL10T15]
C9  0.1uF  [CAPC1005X56X25LL10T15]
D2  PESD0402-140  [FP-PESD0402-MFG]
D3  PESD0402-140  [FP-PESD0402-MFG]
D4  PESD0402-140  [FP-PESD0402-MFG]
J5  U.FL-R-SMT-1(10)  [FP-U_FL-R-SMT-1_10-MFG]
J6  U.FL-R-SMT-1(10)  [FP-U_FL-R-SMT-1_10-MFG]
J7  U.FL-R-SMT-1(10)  [FP-U_FL-R-SMT-1_10-MFG]
R7  10K  [RESC1005X40X25ML05T10]
R8  10K  [RESC1005X40X25ML05T10]
R9  10K  [RESC1005X40X25ML05T10]
R10  33R  [RESC1005X40X25LL05T10]
R11  33R  [RESC1005X40X25LL05T10]
R12  100K  [RESC1005X40X25NL05T10]
R13  10K  [RESC1005X40X25ML05T10]
R14  33R  [RESC1005X40X25LL05T10]
R15  100K  [RESC1005X40X25NL05T10]
U2  SN74AVC4T245RSVR  [RSV0016A_V]
U3  NB3M8302CDG  [SOIC8_ONS]
U4  SN74LVC1G126DRYR  [DRY0006A_V]  (parts A,B of 2)
U5  SN74LVC1G126DRYR  [DRY0006A_V]  (parts A,B of 2)

### Nets
1V8_OUT: C7.2 U2.3(VCCA) U2.5(2DIR)
3V3: C4.1 C5.1 C6.2 C8.2 C9.2 U2.2(VCCB) U3.1(VDDO) U3.2(VDD) U3.6(VDDO) U4.1(OE) U4.6(VCC) U5.1(OE) U5.6(VCC)
GND: C4.2 C5.2 C6.1 C7.1 C8.1 C9.1 D2.1 D3.1 D4.1 J5.2(GND) J5.3(GND) J6.2(GND) J6.3(GND) J7.2(GND) J7.3(GND) R7.1 R8.1 R9.1 R12.1 R13.1 R15.1 U2.1(1~{OE}) U2.4(1DIR) U2.10(GND) U2.11(GND) U2.16(2~{OE}) U3.4(GND) U3.7(GND) U4.3(GND) U5.3(GND)
EXT_EVENT_A: R7.2 R10.2 U2.15(1B1)
EXT_EVENT_B: R8.2 R14.2 U2.14(1B2)
EXT_PPS: U2.13(2B1) U3.3(CLK)
EXT_PPS_OUT: R11.2 R13.2 U3.5(Q1)
GNSS_IN_EVENT_A: U2.6(1A1) ; off-sheet GNSS_IN_EVENT_A
GNSS_IN_EVENT_B: U2.7(1A2) ; off-sheet GNSS_IN_EVENT_B
GNSS_PPSO: R9.2 U2.9(2A2) ; off-sheet GNSS_PPSO
RCB_TP1: U3.8(Q0) ; off-sheet RCB_TP1
NetD2_2: D2.2 J5.1(SIG) R12.2 U4.2(A)
NetD3_2: D3.2 J6.1(SIG) R11.1
NetD4_2: D4.2 J7.1(SIG) R15.2 U5.2(A)
NetR10_1: R10.1 U4.4(Y)
NetR14_1: R14.1 U5.4(Y)

Not connected (* = marked no-connect by the designer): U2 8(2A1)* 12(2B2); U4 5(NC)*; U5 5(NC)*

### Library data of the parts
C4-C9 = CMP-2008-02743-1: as C2 on sheet CONNECTORS
D2-D4 = CMP-08607-000011-1: TVS DIODE 14V 40V 0402; Manufacturer: Littelfuse Inc.; Automotive Grade: Grade 1; Capacitance: 0.25pF; Value: 0.25pF; Direction: Bidirectional; Number Of Channels: 1; Temperature Range Low: -55°C; Lead Free: Yes; Temperature: -55°C to +125°C; Digikey Description: TVS DIODE 14V 40V 0402; Automotive: Yes; Device Class L2: TVS Diodes; Reverse Standoff Voltage: 14V; Device Class L1: Circuit Protection; Ipc Land Pattern Name: DIOC10050X33; Manufacturer Part Number: PESD0402-140; Breakdown Voltage: 14V; Height: 0.43mm; Clamping Voltage: 40V; RoHS: TRUE; Temperature Range High: +125°C; Device Class L3: unset; Octopart: https://octopart.com/pesd0402-140-littelfuse-74215061; Package: PESD0402; ComponentLink2URL: https://www.littelfuse.com/~/media/electronics/datasheets/polymer_esd_suppressors/littelfuse_polymer_esd_suppressor_pesd_catalog_datasheet.pdf.pdf; Category: Diode; ComponentLink2Description: Datasheet
J5-J7 = CMP-2000-05152-3: as J2 on sheet GNSS_A; Packaging: Cut Tape; Length: 3mm; Package Quantity: 2500; Termination: Solder; Lead Free: Lead Free; Series: U.FL; Min Operating Temperature: -40°C; Fastening Type: Snap; Contact Material: Brass; Orientation: Straight; Wire/Cable Type: Coaxial; Frequency: 6GHz; Contact Plating: Gold; Depth: 3.1mm; Weight: 0.001764oz; Max Operating Temperature: 90°C; Radiation Hardening: No; REACH SVHC: No SVHC; Mount: Surface Mount; Housing Color: Beige
R7-R9 R13 = CMP-2002-03043-1: as R23 on sheet GNSS_SUPPORT
R10 R11 R14 = CMP-2002-07619-1: as R20 on sheet GNSS_SUPPORT
R12 R15 = CMP-2002-07343-1: Part Number: RC0402FR-07100KL; Manufacturer: Yageo / Phycomp
U2 = CMP-2000-07132-1: Dual-Bit Bus Transceiver with Configurable Voltage Translation and 3-State Output, 1.2 to 3.6 V, -40 to 85 degC, 16-Pin UQFN (RSV), Green (RoHS & no Sb/Br), Tape and Reel; Manufacturer: Texas Instruments; Propagation Delay Time: 10.3ns; Polarity: Non-Inverting; Low Level Output Current: 12mA; High Level Output Current: -12mA; Quiescent Current: 80uA; Logic Family: AVC; Input Logic Level: CMOS; Number of  Elements: 2; Number of Channels: 4; Operating Supply Voltage (Typ): 1.8/2.5/3.3V; Operating Supply Voltage (Min): 1.2V; Operating Supply Voltage (Max): 3.6V; Technology: CMOS; Package Type: uQFN; Manufacturer URL: http://www.ti.com/; Packaging: TapeandReel; Package URL: http://www.ti.com/lit/ml/mpqf205c/mpqf205c.pdf; Pin Count: 16; Operating Temperature (Max): 85C; Mounting: SurfaceMount; Operating Temperature (Min): -40C; Operating Temperature Classification: Industrial; Package Reference: RSV0016A; Mounting Technology: SurfaceMount; Datasheet Version: Rev. G, 11/2014; Operating Temp Range: -40Cto85C; Rad Hardened: No; Datasheet URL: http://www.ti.com/lit/ds/symlink/sn74avc4t245.pdf; Output Logic Level: CMOS; Output Type: 3-State; Package Description: 16-Pin Quad Flat No-lead Package, Body 1.8 x 2.6 mm, Pitch 0.4 mm
U3 = NB3M8302CDG: No Description Available; Mfr_Name: onsemi; Copyright: Copyright (C) 2023 Ultra Librarian. All rights reserved.; Manufacturer_Part_Number: NB3M8302CDG; Digi-Key_Part_Number_1: NB3M8302CDG-ND; Digi-Key_Part_Number_2: NB3M8302CDGOS-ND; Digi-Key_Part_Number_3: 2156-NB3M8302CDG-OS-ND; RefDes: RefDes; Type: DEV
U4 U5 = CMP-0859-00836-3: as U9 on sheet GNSS_SUPPORT; DatasheetVersion: SCES224R; Generic Part Number: SN74LVC1G126; PackageReference: DRY0006A; Operating Temperature Range(C): -40 to 125,-40 to 85

## Sheet POWER.SchDoc
size A4; SheetNumber: 7; SheetTotal: 7; SPICEModelCacheBESSMCSR: <root> / <DocumentId>BESSMCSR</DocumentId> / </root>
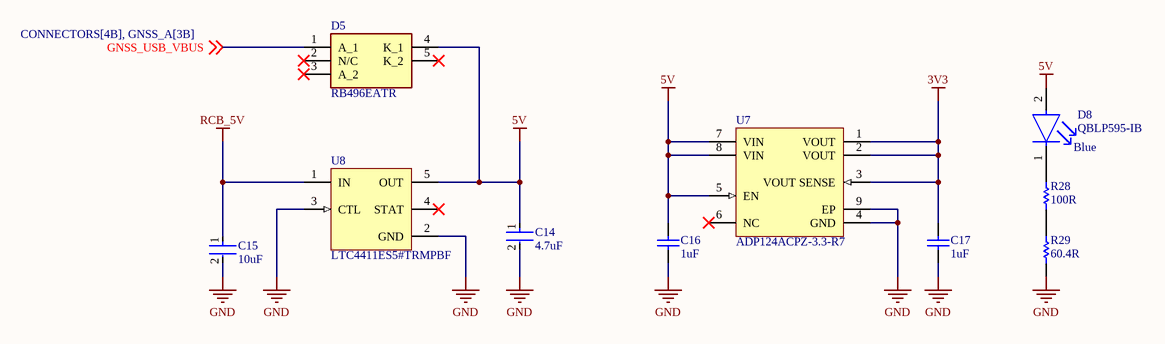
[diagram p5: POWER.SchDoc]

### Parts
C14  4.7uF  [FP-C1005-050-0_15-MFG]
C15  10uF  [FP-0603-L_1_6_0_2-W_0_8_0-MFG]
C16  1uF  [CAPC1005X55X25ML05T10]
C17  1uF  [CAPC1005X55X25ML05T10]
D5  RB496EATR  [SOT95P280X100-5N]
D8  QBLP595-IB  Color: Blue  [FP-QBLP595-IB-MFG]
R28  100R  [RESC1005X40X25LL05T05]
R29  60.4R  [RESC1005X40X25ML05T05]
U7  ADP124ACPZ-3.3-R7  [ADI-CP-8-8_V]
U8  LTC4411ES5#TRMPBF  [LT-S5-5-TSOT-23_N]

### Nets
3V3: C17.2 U7.1(VOUT) U7.2(VOUT) U7.3(VOUT_SENSE)
5V: C14.1 C16.2 D5.4(K_1) D8.2(A) U7.5(EN) U7.7(VIN) U7.8(VIN) U8.5(OUT)
GND: C14.2 C15.2 C16.1 C17.1 R29.2 U7.4(GND) U7.9(EP) U8.2(GND) U8.3(CTL)
RCB_5V: C15.1 U8.1(IN)
GNSS_USB_VBUS: D5.1(A_1) ; off-sheet GNSS_USB_VBUS
NetD8_1: D8.1(C) R28.2
NetR28_1: R28.1 R29.1

Not connected (* = marked no-connect by the designer): D5 2(N/C)* 3(A_2)* 5(K_2)*; U7 6(NC)*; U8 4(STAT)*

### Library data of the parts
C14 = CMP-2000-05997-2: CAP CER 4.7UF 10V X5R 0402; Dielectric Material: Ceramic; Tolerance: 10%; Series: C; Package Quantity: 10000; Max Operating Temperature: 85°C; Case Code (Imperial): 0402; Lead Free: Lead Free; Voltage Rating (DC): 10V; Packaging: Cut Tape; Voltage Rating: 10V; Min Operating Temperature: -55°C; Dielectric: X5R; Thickness: 0.022inch; Width: 0.02inch; Case/Package: 0402; Case Code (Metric): 1005; Capacitance: 4.7uF; Length: 0.039inch; RoHS Compliant: Yes; REACH SVHC: No SVHC; Mount: Surface Mount
C15 = CMP-2000-06226-4: Multilayer Ceramic Capacitor 10uF 16V X5R 20% SMD 0603 T/R; Packaging: Tape and Reel; Construction: Flat; Height: 0.8mm; Max Operating Temperature: 85°C; Dielectric: X5R; Case Code (Metric): 1608; Voltage Rating (DC): 16V; Width: 0.031inch; Voltage Rating: 16V; Length: 0.063inch; RoHS Compliant: Yes; Halogen Free: Halogen Free; Case Code (Imperial): 0603; Capacitance: 10uF; Mount: Surface Mount; Thickness: 0.031inch; Tolerance: 20%; Min Operating Temperature: -55°C; Series: M; Termination: SMD/SMT; Case/Package: 0603; Package Quantity: 1
C16 C17 = CMP-2008-04506-1: Part Number: GRM155C80J105KE15D; Manufacturer: Murata
D5 = RB496EATR: Schottky Diode; Manufacturer_Name: ROHM Semiconductor; Datasheet Link: https://fscdn.rohm.com/en/products/databook/datasheet/discrete/diode/schottky_barrier/rb496eatr-e.pdf; Height: 1mm; Manufacturer_Part_Number: RB496EATR; Mouser Part Number: 755-RB496EATR; Mouser Price/Stock: https://www.mouser.co.uk/ProductDetail/ROHM-Semiconductor/RB496EATR/?qs=4kLU8WoGk0tzYHEk1W59vw%3D%3D
D8 = CMP-113271-000002-1: LED BLUE CLEAR 0402 SMD; Lens Size: 0.5mm; Dominant Wavelength: 465nm; Forward Voltage: 3.1V; Lens Color: Colorless; Luminous Intensity: 85mcd; Test Current: 20mA; Viewing Angle: 140°; Lens Style: Flat; Width: 0.5mm; Case Code (Metric): 1005; Lens Transparency: Clear; Packaging: Tape and Reel; Case Code (Imperial): 0402; Mount: Surface Mount; Length: 1mm; Case/Package: 0402; Height: 0.6mm
R28 = CMP-2002-00605-3: as R30 on sheet GNSS_SUPPORT; Width: 0.5 mm; Pins: 2; ComponentLink2Description: Datasheet; PackageReference: 0402; Height: 0.35 mm; Tolerance: 1%; DatasheetVersion: 04/2015; Case Code (Imperial): 0402; Min Operating Temperature: -55 degC; Radiation Hardening: No; Length: 1 mm; Package Quantity: 10000; PackageDescription: 2-Pin Surface Mount Device, Body 1 x 0.5 mm; Mounting Technology: Surface Mount; Case Code (Metric): 1005; Packaging: Tape and Reel; ComponentLink1URL: http://www.panasonic.com/; RoHSCompliant: true; Max Operating Temperature: 155 degC; REACH SVHC: Yes; ComponentLink1Description: Manufacturer URL; ComponentLink2URL: http://industrial.panasonic.com/cdbs/www-data/pdf/RDA0000/AOA0000C86.pdf; Mount: Surface Mount
R29 = CMP-2002-01009-1: as R24 on sheet GNSS_SUPPORT
U7 = CMP-0786-00127-1: 500 mA, Low Quiescent Current, CMOS Linear Regulator, 2.3 to 5.5 V Vin, 3.3 V Vout, Industrial, 8-pin SON (CP-8-8), Reel; Manufacturer: Analog Devices; Iout max: 500mA; Preset Vout Values (V): 3.3; Supply Current IGND @ Small Load: 45uA; Vin (min) (V): 2.3; Vin (max) (V): 5.5; Mounting Technology: Surface Mount; PackageVersion: 101028-A, 10/2008; ComponentLink3URL: http:/www.analog.com/static/imported-files/packages/PKG_PDF/LFCSP(CP)/CP_8_8.pdf; DatasheetVersion: Rev. C; ComponentLink1Description: Manufacturer URL; PartNumber: ADP124ACPZ-3.3-R7; ComponentLink2Description: Datasheet; ComponentLink4URL: Product URL:http://www.analog.com/en/ADP124/productSearch.html; ComponentLink1URL: http://www.analog.com/en/index.html; PackageReference: CP-8-8; ComponentLink2URL: http://www.analog.com/static/imported-files/data_sheets/ADP124_125.pdf; ComponentLink4Description: URL Link1; PackageDescription: 8-Pin Lead Frame Chip Scale Package, Body 2 x 2 mm, Pitch 0.5 mm; Packing: Reel; ComponentLink3Description: Package Specification
U8 = CMP-0479-00414-1: Integrated Switch: Replaces Power Supply OR, 2.6 to 5.5 V Vin, 5-pin SOT23 (S5-5), -40 to 85 degC, Pb-Free, Mini Tape and Reel; Manufacturer: Linear Technology; Ideal Diode: Single, Internal, P-Channel; ComponentLink2Description: Datasheet; ComponentLink1URL: http://www.linear.com/; RoHS: TRUE; PackageDescription: 5-Pin Plastic TSOT-23, Body 1.63 x 2.90 mm, Pitch 0.95 mm; PackageReference: S5-5; Mounting Technology: Surface Mount; PackageVersion: Jun-10; ComponentLink3URL: http://cds.linear.com/docs/en/packaging/SOT_5_05-08-1635.pdf; PartNumber: LTC4411ES5#TRMPBF; ComponentLink3Description: Package Specification; Code_JEDEC: MO-193; ComponentLink2URL: http://cds.linear.com/docs/en/datasheet/4411fa.pdf; Packing: Mini Tape and Reel; ComponentLink1Description: Manufacturer URL; DatasheetVersion: Rev. A

## Nets that join several sheets
1V8_OUT: GNSS_A (R1.2 U1.AC4), REF_TIMING (C7.2 U2.3 U2.5)
3V3: GNSS_A (12 pins), GNSS_SUPPORT (12 pins), REF_TIMING (13 pins), POWER (C17.2 U7.1 U7.2 U7.3)
5V: GNSS_A (R17.1), POWER (8 pins)
GND: CONNECTORS (5 pins), GNSS_A (9 pins), GNSS_B (112 pins), GNSS_SUPPORT (17 pins), REF_TIMING (30 pins), POWER (9 pins)
RCB_5V: CONNECTORS (J1.1), POWER (C15.1 U8.1)
EXT_REF: GNSS_A (R5.2), GNSS_SUPPORT (R21.2 R22.2)
GNSS_GPLED: GNSS_A (U1.A14), GNSS_SUPPORT (R27.2 U10.2)
GNSS_IN_EVENT_A: GNSS_A (U1.AC6), REF_TIMING (U2.6)
GNSS_IN_EVENT_B: GNSS_A (U1.AC7), REF_TIMING (U2.7)
GNSS_MODULE_RDY: GNSS_A (U1.A12), GNSS_SUPPORT (R25.2 U9.2)
GNSS_PPSO: GNSS_A (U1.AC8), REF_TIMING (R9.2 U2.9)
GNSS_RST: GNSS_A (U1.A11), GNSS_SUPPORT (U6.4)
GNSS_UART_RX1: CONNECTORS (J1.5), GNSS_A (U1.B1), GNSS_SUPPORT (D9.2)
GNSS_UART_TX1: CONNECTORS (J1.3), GNSS_A (U1.D1), GNSS_SUPPORT (D9.1)
GNSS_USB_DM_N: CONNECTORS (L1.2), GNSS_A (U1.A6)
GNSS_USB_DM_P: CONNECTORS (L1.3), GNSS_A (U1.A5)
GNSS_USB_VBUS: CONNECTORS (D1.5 J4.1), GNSS_A (U1.A8), POWER (D5.1)
RCB_nRST: CONNECTORS (J1.4), GNSS_SUPPORT (R19.1 U6.2)
RCB_TP1: CONNECTORS (J1.6), REF_TIMING (U3.8)